# Altium schematic sheet Top.SchDoc
size A3; SheetNumber: 1
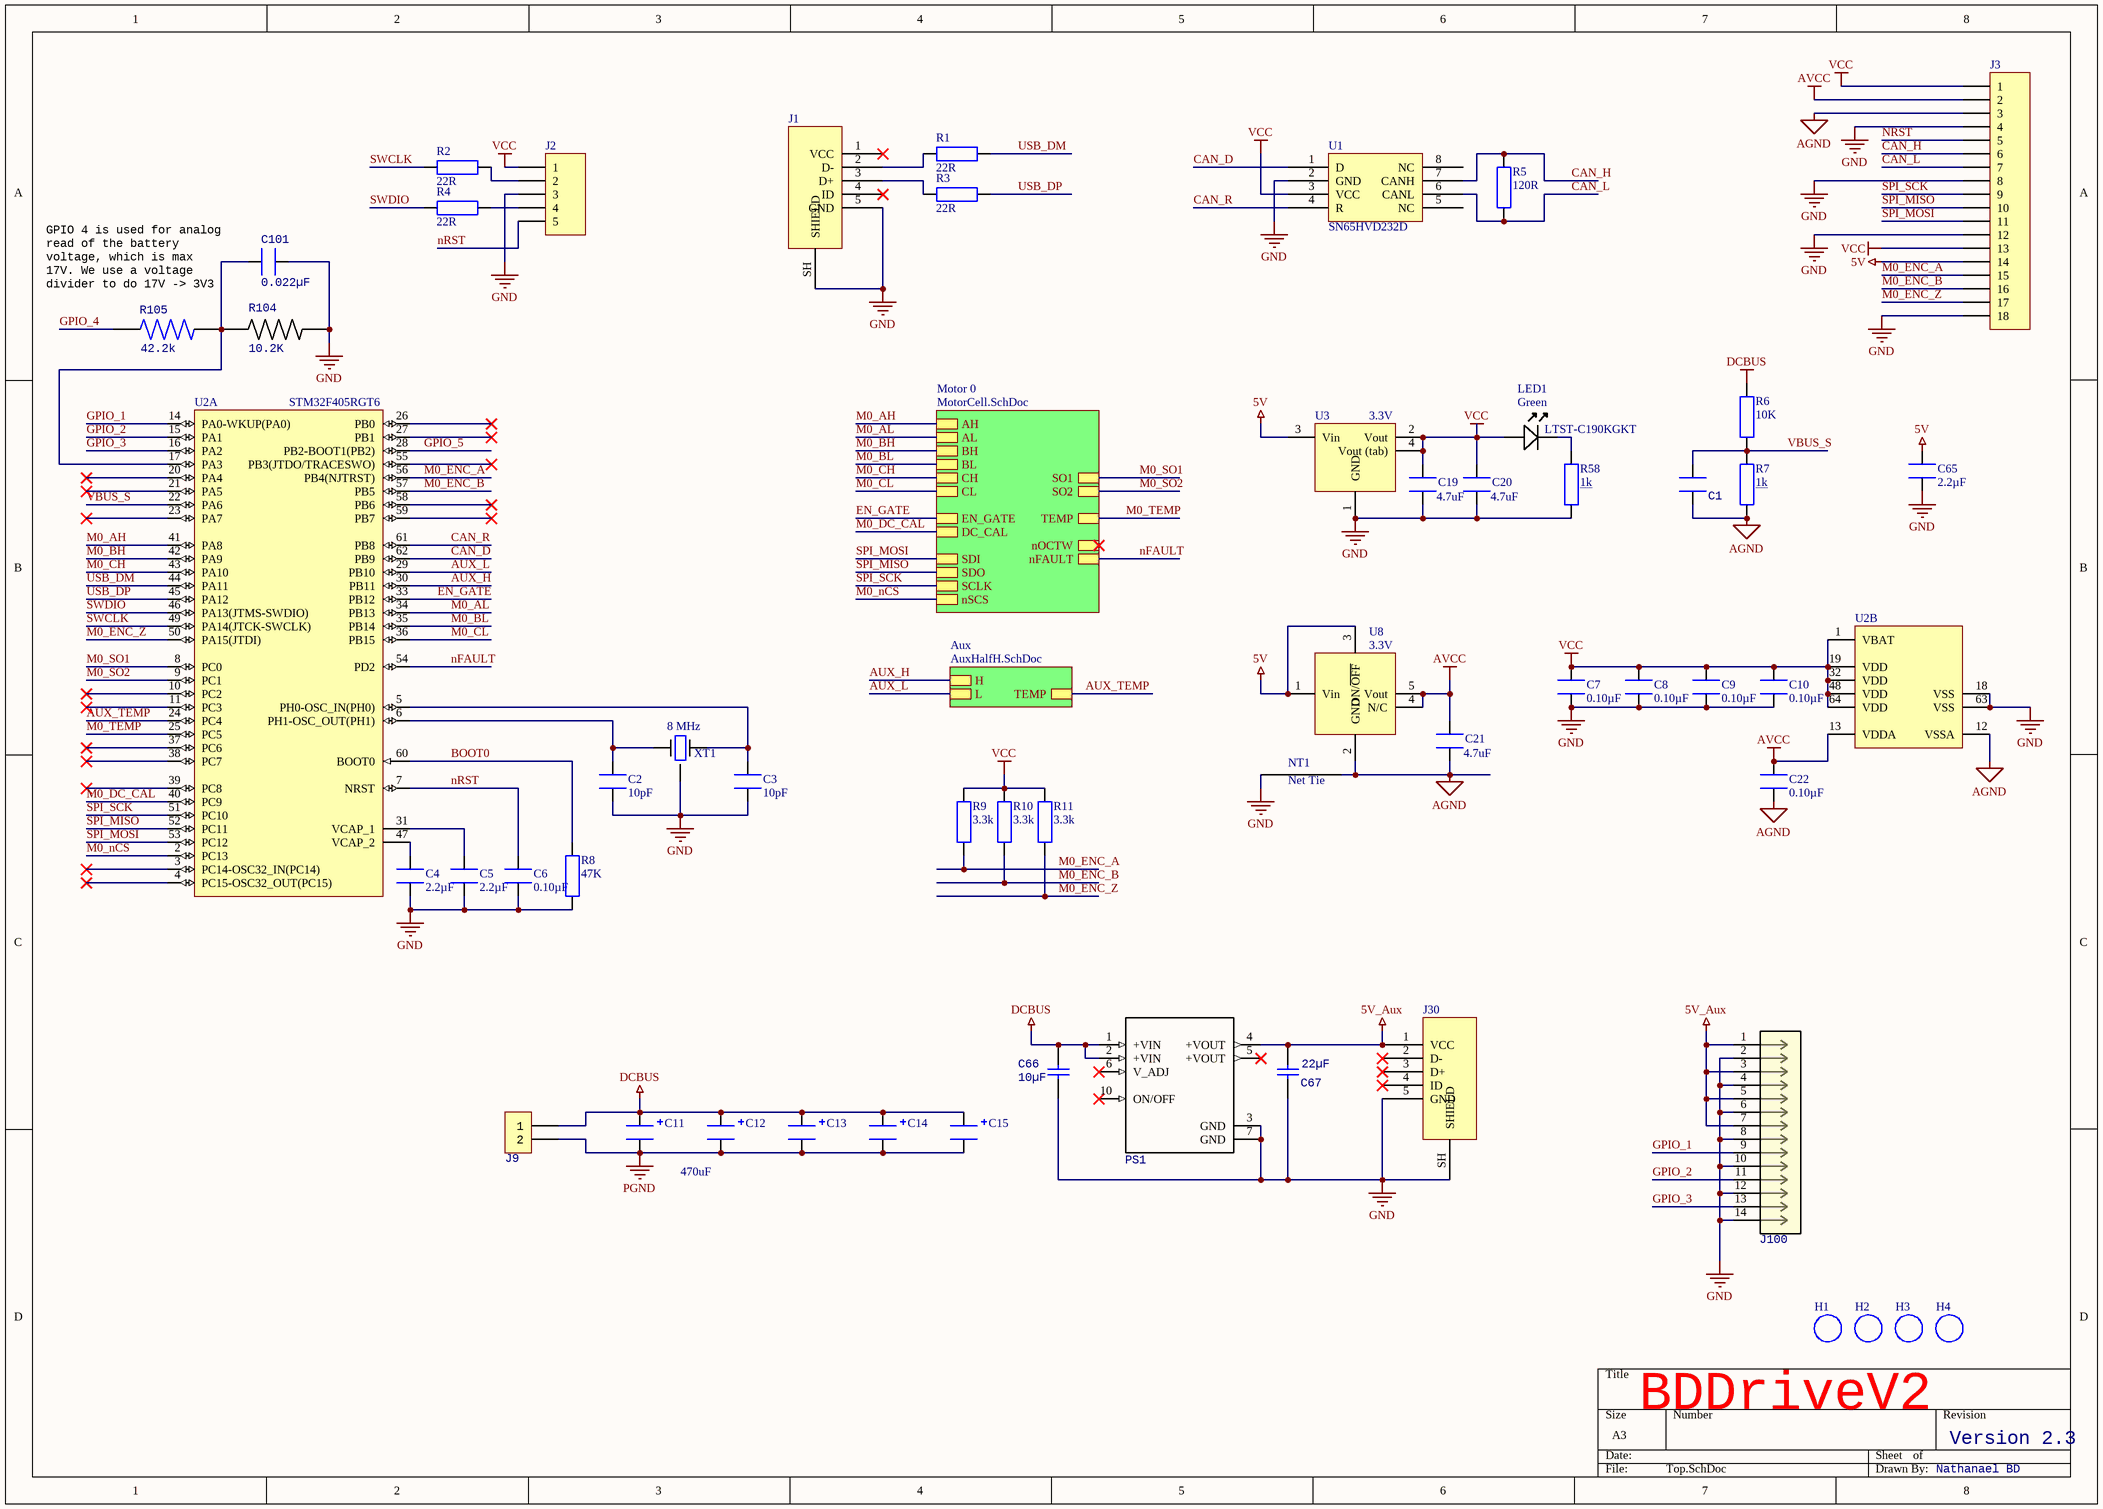
[diagram p0: Top.SchDoc]

## Parts
C1  270pF  [CAPC1608X09L]  (value not drawn)
C2  10pF  [CAPC1608X09L]
C3  10pF  [CAPC1608X09L]
C4  2.2µF  [CAPC1608X09L]
C5  2.2µF  [CAPC1608X09L]
C6  0.10µF  [CAPC1608X09L]
C7  0.10µF  [CAPC1608X09L]
C8  0.10µF  [CAPC1608X09L]
C9  0.10µF  [CAPC1608X09L]
C10  0.10µF  [CAPC1608X09L]
C11  470uF  [CAP_ELEC_SIZE_G]
C12  470uF  [CAP_ELEC_SIZE_G]  (value not drawn)
C13  470uF  [CAP_ELEC_SIZE_G]  (value not drawn)
C14  470uF  [CAP_ELEC_SIZE_G]  (value not drawn)
C15  470uF  [CAP_ELEC_SIZE_G]  (value not drawn)
C19  4.7uF  [CAPC2012X09N]
C20  4.7uF  [CAPC2012X09N]
C21  4.7uF  [CAPC2012X09N]
C22  0.10µF  [CAPC1608X09L]
C65  2.2µF  [CAPC1608X09L]
C66  10µF  [1206 CAP]
C67  22µF  [0805 Cap]
C101  0.022µF  [CAPC1608X09L]
H1  (no value)  [M3 Hole]
H2  (no value)  [M3 Hole]
H3  (no value)  [M3 Hole]
H4  (no value)  [M3 Hole]
J1  (no value)  [USB_0103594-0001LF]
J2  (no value)  [HDR1X5]
J3  Header 18  [HDR1X18]  (value not drawn)
J9  0436500227  [0436500227]  (value not drawn)
J30  (no value)  [USB_0103594-0001LF]
J100  Part Number: 67996-114HLF  [67996-114HLF_AMP]  (value not drawn)
LED1  Green  [LED-0603-GREEN]
NT1  (no value)  [NetTie_2mm]  (net tie, no BOM)
PS1  V78E05-1000-SMT-TR  [V78E05-1000-SMT-TR]  (value not drawn)
R1  22R  [RESC1608X55N]
R2  22R  [RESC1608X55N]
R3  22R  [RESC1608X55N]
R4  22R  [RESC1608X55N]
R5  120R  [RESC1608X55N]
R6  10K  [RESC1608X06L]
R7  1k  [RESC1608X55N]
R8  47K  [RESC1608X55N]
R9  3.3k  [RESC1608X55N]
R10  3.3k  [RESC1608X55N]
R11  3.3k  [RESC1608X55N]
R58  1k  [RESC1608X55N]
R104  10.2K  [RESC2012X60N]
R105  42.2k  [RESC2012X60N]
U1  (no value)  [SOIC127P600X175-8N]
U2  (no value)  [STM-LQFP64_N]  (parts A,B of 2)
U3  3.3V  [SOT223]
U8  3.3V  [SOT23-5]
XT1  value 8 MHz  [DFN220P320X110-4N]  (hidden comment: ABM3B-8.000MHZ-10-1-U-T)

## Sub-sheets
Aux = AuxHalfH.SchDoc: H, L, TEMP
Motor 0 = MotorCell.SchDoc: nFAULT, nOCTW, EN_GATE, DC_CAL, SDI, SDO, SCLK, nSCS, SO1, SO2, AH, AL, BH, BL, CH, CL, TEMP

## Nets
5V: C65.2 J3.14 U3.3(Vin) U8.1(Vin) U8.3(ON/~{OFF})
5V_Aux: C67.1 J30.1(VCC) J100.1 J100.3 J100.5 J100.7 PS1.4(+VOUT)
AGND: C1.1 C21.1 C22.2 J3.3 NT1.2 R7.1 U2.12(VSSA) U8.2(GND)
AVCC: C21.2 C22.1 J3.2 U2.13(VDDA) U8.4(N/C) U8.5(Vout)
DCBUS: C11.1 C12.1 C13.1 C14.1 C15.1 C66.1 J9.1 PS1.1(+VIN) PS1.2(+VIN) R6.2
GND: C2.2 C3.2 C4.1 C5.1 C6.1 C7.2 C8.2 C9.2 C10.2 C19.1 C20.1 C65.1 C66.2 C67.2 C101.1 J1.5(GND) J1.SH(SHIELD) J2.3 J3.4 J3.8 J3.12 J3.18 J30.5(GND) J30.SH(SHIELD) J100.2 J100.4 J100.6 J100.8 J100.10 J100.12 J100.14 NT1.1 PS1.3(GND) PS1.7(GND) R8.1 R58.2 R104.2 U1.2(GND) U2.18(VSS) U2.63(VSS) U3.1(GND) XT1.G
PGND: C11.2 C12.2 C13.2 C14.2 C15.2 J9.2
VCC: C7.1 C8.1 C9.1 C10.1 C19.2 C20.2 J2.1 J3.1 J3.13 LED1.A R9.2 R10.2 R11.2 U1.3(VCC) U2.1(VBAT) U2.19(VDD) U2.32(VDD) U2.48(VDD) U2.64(VDD) U3.2(Vout) U3.4(Vout_(tab))
AUX_H: U2.30(PB11) ; sheet Aux/H
AUX_L: U2.29(PB10) ; sheet Aux/L
AUX_TEMP: U2.24(PC4) ; sheet Aux/TEMP
BOOT0: R8.2 U2.60(BOOT0)
CAN_D: U1.1(D) U2.62(PB9)
CAN_H: J3.6 R5.2 U1.7(CANH)
CAN_L: J3.7 R5.1 U1.6(CANL)
CAN_R: U1.4(R) U2.61(PB8)
EN_GATE: U2.33(PB12) ; sheet Motor 0/EN_GATE
GPIO_1: J100.9 U2.14(PA0-WKUP(PA0))
GPIO_2: J100.11 U2.15(PA1)
GPIO_3: J100.13 U2.16(PA2)
GPIO_4: R105.1
GPIO_5: U2.28(PB2-BOOT1(PB2))
M0_AH: U2.41(PA8) ; sheet Motor 0/AH
M0_AL: U2.34(PB13) ; sheet Motor 0/AL
M0_BH: U2.42(PA9) ; sheet Motor 0/BH
M0_BL: U2.35(PB14) ; sheet Motor 0/BL
M0_CH: U2.43(PA10) ; sheet Motor 0/CH
M0_CL: U2.36(PB15) ; sheet Motor 0/CL
M0_DC_CAL: U2.40(PC9) ; sheet Motor 0/DC_CAL
M0_ENC_A: J3.15 R9.1 U2.56(PB4(NJTRST))
M0_ENC_B: J3.16 R10.1 U2.57(PB5)
M0_ENC_Z: J3.17 R11.1 U2.50(PA15(JTDI))
M0_nCS: U2.2(PC13) ; sheet Motor 0/nSCS
M0_SO1: U2.8(PC0) ; sheet Motor 0/SO1
M0_SO2: U2.9(PC1) ; sheet Motor 0/SO2
M0_TEMP: U2.25(PC5) ; sheet Motor 0/TEMP
nFAULT: U2.54(PD2) ; sheet Motor 0/nFAULT
nRST: C6.2 J2.5 J3.5 U2.7(NRST)
SPI_MISO: J3.10 U2.52(PC11) ; sheet Motor 0/SDO
SPI_MOSI: J3.11 U2.53(PC12) ; sheet Motor 0/SDI
SPI_SCK: J3.9 U2.51(PC10) ; sheet Motor 0/SCLK
SWCLK: R2.2 U2.49(PA14(JTCK-SWCLK))
SWDIO: R4.2 U2.46(PA13(JTMS-SWDIO))
USB_DM: R1.1 U2.44(PA11)
USB_DP: R3.1 U2.45(PA12)
VBUS_S: C1.2 R6.1 R7.2 U2.22(PA6)
NetC2_1: C2.1 U2.6(PH1-OSC_OUT(PH1)) XT1.1
NetC3_1: C3.1 U2.5(PH0-OSC_IN(PH0)) XT1.3
NetC4_2: C4.2 U2.47(VCAP_2)
NetC5_2: C5.2 U2.31(VCAP_1)
NetC101_2: C101.2 R104.1 R105.2 U2.17(PA3)
NetJ1_2: J1.2(D-) R1.2
NetJ1_3: J1.3(D+) R3.2
NetJ2_2: J2.2 R2.1
NetJ2_4: J2.4 R4.1
NetLED1_K: LED1.K R58.1

Not connected (* = marked no-connect by the designer): J1 1(VCC)* 4(ID)*; J30 2(D-)* 3(D+)* 4(ID)*; PS1 5(+VOUT)* 6(V_ADJ)* 10(ON/OFF)*; U1 5(NC) 8(NC); U2 3(PC14-OSC32_IN(PC14))* 4(PC15-OSC32_OUT(PC15))* 10(PC2)* 11(PC3)* 20(PA4)* 21(PA5)* 23(PA7)* 26(PB0)* 27(PB1)* 37(PC6)* 38(PC7)* 39(PC8)* 55(PB3(JTDO/TRACESWO))* 58(PB6)* 59(PB7)*

## Notes on the sheet
- GPIO 4 is used for analog read of the battery voltage, which is max 17V. We use a voltage divider to do 17V -> 3V3
- BDDriveV2
- Version 2.3
- Nathanael BD
- (in symbol NetTie_2mm) Net Tie

## Library data of the parts
C1 = GRM1885C1H271JA01D: CAP CER 270PF 50V NP0 0603; Manufacturer: Murata Electronics North America; Tolerance: ±5%; Temperature Coefficient: C0G, NP0; Supplier 1: Digi-Key; Supplier Part Number 1: 490-1437-1-ND; Manufacturer Part Number: GRM1885C1H271JA01D; RoHS: RoHS Compliant; Category: Capacitors; Stock 1: 46048; Pricing 1: 1=0.1, 10=0.048, 50=0.026, 100=0.022, 250=0.018, 500=0.0154, 1000=0.012 (USD); Packaging: Cut Tape (CT); Capacitance: 270pF; Voltage - Rated: 50V; Mounting Type: Surface Mount, MLCC; Operating Temperature: -55°C ~ 125°C; Applications: General Purpose; Ratings: -; Package / Case: 0603 (1608 Metric); Size / Dimension: 0.063" L x 0.031" W (1.60mm x 0.80mm); Height - Seated (Max): -; Thickness (Max): 0.035" (0.90mm); Lead Spacing: -; Features: -; Lead Style: -; ComponentLink1URL: http://www.murata.com/~/media/webrenewal/support/library/catalog/products/capacitor/mlcc/c02e.pdf; ComponentLink1Description: http://www.murata.com/~/media/webrenewal/support/library/catalog/products/capacitor/mlcc/c02e.pdf
C2 C3 = GRM1885C1H100JA01D: CAP CER 10PF 50V NP0 0603; Manufacturer: Murata Electronics North America; Tolerance: ±5%; Temperature Coefficient: C0G, NP0; Supplier 1: Digi-Key; Supplier Part Number 1: 490-1403-1-ND; Manufacturer Part Number: GRM1885C1H100JA01D; RoHS: RoHS Compliant; Category: Capacitors; Stock 1: 450321; Pricing 1: 1=0.1, 10=0.041, 50=0.0222, 100=0.0187, 250=0.01532, 500=0.0131, 1000=0.0102 (USD); Packaging: Cut Tape (CT); Capacitance: 10pF; Voltage - Rated: 50V; Mounting Type: Surface Mount, MLCC; Operating Temperature: -55°C ~ 125°C; Applications: General Purpose; Ratings: -; Package / Case: 0603 (1608 Metric); Size / Dimension: 0.063" L x 0.031" W (1.60mm x 0.80mm); Height - Seated (Max): -; Thickness (Max): 0.035" (0.90mm); Lead Spacing: -; Features: -; Lead Style: -; ComponentLink1URL: http://www.murata.com/~/media/webrenewal/support/library/catalog/products/capacitor/mlcc/c02e.pdf; ComponentLink1Description: http://www.murata.com/~/media/webrenewal/support/library/catalog/products/capacitor/mlcc/c02e.pdf
C4 C5 C65 = GRM188R61C225KE15D: CAP CER 2.2UF 16V X5R 0603; Manufacturer: Murata Electronics North America; Tolerance: ±10%; Supplier 1: Digi-Key; Supplier Part Number 1: 490-3296-1-ND; Manufacturer Part Number: GRM188R61C225KE15D; RoHS: RoHS Compliant; Category: Capacitors; Stock 1: 1255740; Pricing 1: 1=0.12, 10=0.08, 50=0.046, 100=0.038, 250=0.032, 500=0.0268, 1000=0.022 (USD); Packaging: Cut Tape (CT); Capacitance: 2.2µF; Voltage - Rated: 16V; Temperature Coefficient: X5R; Mounting Type: Surface Mount, MLCC; Operating Temperature: -55°C ~ 85°C; Applications: General Purpose; Ratings: -; Package / Case: 0603 (1608 Metric); Size / Dimension: 0.063" L x 0.031" W (1.60mm x 0.80mm); Height - Seated (Max): -; Thickness (Max): 0.035" (0.90mm); Lead Spacing: -; Features: -; Lead Style: -; ComponentLink1URL: http://www.murata.com/~/media/webrenewal/support/library/catalog/products/capacitor/mlcc/c02e.pdf; ComponentLink1Description: http://www.murata.com/~/media/webrenewal/support/library/catalog/products/capacitor/mlcc/c02e.pdf
C6-C10 C22 = GRM188R71E104KA01D: CAP CER 0.1UF 25V X7R 0603; Manufacturer: Murata Electronics North America; Tolerance: ±10%; Supplier 1: Digi-Key; Supplier Part Number 1: 490-1524-1-ND; Manufacturer Part Number: GRM188R71E104KA01D; RoHS: RoHS Compliant; Category: Capacitors; Stock 1: 1667481; Pricing 1: 1=0.1, 10=0.019, 50=0.0104, 100=0.0088, 250=0.0072, 500=0.00616, 1000=0.0048 (USD); Packaging: Cut Tape (CT); Capacitance: 0.10µF; Voltage - Rated: 25V; Temperature Coefficient: X7R; Mounting Type: Surface Mount, MLCC; Operating Temperature: -55°C ~ 125°C; Applications: General Purpose; Ratings: -; Package / Case: 0603 (1608 Metric); Size / Dimension: 0.063" L x 0.031" W (1.60mm x 0.80mm); Height - Seated (Max): -; Thickness (Max): 0.035" (0.90mm); Lead Spacing: -; Features: -; Lead Style: -; ComponentLink1URL: http://www.murata.com/~/media/webrenewal/support/library/catalog/products/capacitor/mlcc/c02e.pdf; ComponentLink1Description: http://www.murata.com/~/media/webrenewal/support/library/catalog/products/capacitor/mlcc/c02e.pdf
C11-C15 = EEEFP1E471AP: CAP, FP Series, 470 µF, 25 V, Radial Can - SMD, 10 mm
C19-C21 = GRM219R6YA475KA73D: CAP CER 4.7UF 35V X5R 0805
C66 = CL31A106KBHNNNE: CAP CER 10UF 50V X5R 1206; Manufacturer: Samsung Electro-Mechanics America, Inc.; Tolerance: ±10%; Supplier 1: Digi-Key; Supplier Part Number 1: 1276-2876-1-ND; Manufacturer Part Number: CL31A106KBHNNNE; RoHS: RoHS Compliant; Category: Capacitors; Stock 1: 486982; Pricing 1: 1=0.78, 10=0.554, 25=0.4724, 50=0.4184, 100=0.3644, 250=0.31036, 500=0.2699, 1000=0.22942 (CAD); Packaging: Cut Tape (CT); Part Status: Active; Capacitance: 10µF; Voltage - Rated: 50V; Temperature Coefficient: X5R; Operating Temperature: -55°C ~ 85°C; Features: -; Ratings: -; Applications: General Purpose; Mounting Type: Surface Mount, MLCC; Package / Case: 1206 (3216 Metric); Size / Dimension: 0.126" L x 0.063" W (3.20mm x 1.60mm); Height - Seated (Max): -; Thickness (Max): 0.071" (1.80mm); Lead Spacing: -; Lead Style: -; ComponentLink1URL: http://www.samsungsem.com/kr/support/product-search/mlcc/__icsFiles/afieldfile/2016/08/18/S_CL31A106KBHNNNE.pdf; ComponentLink1Description: http://www.samsungsem.com/kr/support/product-search/mlcc/__icsFiles/afieldfile/2016/08/18/S_CL31A106KBHNNNE.pdf
C67 = GRM21BR61E226ME44L: CAP CER 22UF 25V X5R 0805; Manufacturer: Murata Electronics North America; Tolerance: ±20%; Supplier 1: Digi-Key; Supplier Part Number 1: 490-10749-1-ND; Manufacturer Part Number: GRM21BR61E226ME44L; RoHS: RoHS Compliant; Category: Capacitors; Stock 1: 29225; Pricing 1: 1=0.77, 10=0.67, 50=0.4068, 100=0.335, 250=0.26796, 500=0.24406, 1000=0.22013 (CAD); Packaging: Cut Tape (CT); Capacitance: 22µF; Voltage - Rated: 25V; Temperature Coefficient: X5R; Mounting Type: Surface Mount, MLCC; Operating Temperature: -55°C ~ 85°C; Applications: General Purpose; Ratings: -; Package / Case: 0805 (2012 Metric); Size / Dimension: 0.079" L x 0.049" W (2.00mm x 1.25mm); Height - Seated (Max): -; Thickness (Max): 0.057" (1.45mm); Lead Spacing: -; Features: -; Lead Style: -; ComponentLink1URL: http://www.murata.com/~/media/webrenewal/support/library/catalog/products/capacitor/mlcc/c02e.pdf; ComponentLink1Description: http://www.murata.com/~/media/webrenewal/support/library/catalog/products/capacitor/mlcc/c02e.pdf
C101 = GRM188R71E223KA01D: CAP CER 0.022UF 25V X7R 0603; Manufacturer: Murata Electronics North America; Tolerance: ±10%; Supplier 1: Digi-Key; Supplier Part Number 1: 490-9761-1-ND; Manufacturer Part Number: GRM188R71E223KA01D; RoHS: RoHS Compliant; Category: Capacitors; Stock 1: 26666; Pricing 1: 1=0.1, 10=0.061, 50=0.0332, 100=0.0281, 250=0.02296, 500=0.01964, 1000=0.0153 (USD); Packaging: Cut Tape (CT); Capacitance: 0.022µF; Voltage - Rated: 25V; Temperature Coefficient: X7R; Mounting Type: Surface Mount, MLCC; Operating Temperature: -55°C ~ 125°C; Applications: General Purpose; Ratings: -; Package / Case: 0603 (1608 Metric); Size / Dimension: 0.063" L x 0.031" W (1.60mm x 0.80mm); Height - Seated (Max): -; Thickness (Max): 0.035" (0.90mm); Lead Spacing: -; Features: -; Lead Style: -; ComponentLink1URL: http://www.murata.com/~/media/webrenewal/support/library/catalog/products/capacitor/mlcc/c02e.pdf; ComponentLink1Description: http://www.murata.com/~/media/webrenewal/support/library/catalog/products/capacitor/mlcc/c02e.pdf
H1-H4 = M3 Hole: M3 Hole with no copper
J1 J30 = 10103594-0001LF: MICRO USB B, RECEPTACLE, SMT, RA, 5WAY; Supplier 1: Farnell; Supplier Part Number 1: 2293752
J2 = Header 5: Header, 5-Pin; LatestRevisionDate: 17-Jul-2002; LatestRevisionNote: Re-released for DXP Platform.; Publisher: Altium Limited
J3 = Header 18: Header, 18-Pin; LatestRevisionDate: 17-Jul-2002; LatestRevisionNote: Re-released for DXP Platform.; Publisher: Altium Limited
J9 = 0436500227: CONN HEADER 2POS VERT TIN T/H; Manufacturer: Molex, LLC; Manufacturer Part Number: 0436500203; Connector Type: Header, Shrouded; Number of Positions: 2; Number of Positions Loaded: All; Pitch: 0.118" (3.00mm); Supplier 1: Digi-Key; Supplier Part Number 1: WM1870-ND; RoHS: RoHS Compliant; Category: Connectors, Interconnects; Stock 1: 8698; Pricing 1: 1=1.38, 10=1.21, 50=1.0908, 100=1.0433, 250=0.94844, 500=0.85358, 1000=0.75874, 2500=0.68761, 5000=0.66389 (CAD); Packaging: Tray; Contact Type: Male Pin; Number of Rows: 1; Row Spacing: -; Contact Mating Length: -; Mounting Type: Through Hole, Right Angle; Termination: Solder; Fastening Type: Locking Ramp; Features: Board Lock; Contact Finish: Tin; Contact Finish Thickness: 100µin (2.54µm); Color: Black; ComponentLink1URL: http://www.molex.com/pdm_docs/sd/436500203_sd.pdf; ComponentLink1Description: http://www.molex.com/pdm_docs/sd/436500203_sd.pdf
J100 = 67996-114HLF: No Description Available; Vendor: Amphenol; Built_By: EMA_UL_Team; SourceLibrary: Amphenol_2013-08-06_Bergstik_2Row_67996; Manufacturer_Part_Number: 67996-114HLF; Copyright: Copyright (C) 2018 Accelerated Designs. All rights reserved; RefDes: RefDes; Type: DEV; Value: Value
LED1 = LTST-C190KGKT: LED GREEN CLEAR 0603 SMD; Manufacturer: Lite-On Inc.; Lens Color: Colorless; Millicandela Rating: 35mcd; Lens Style/Size: Rectangle with Flat Top, 1.10mm x 0.80mm; Voltage - Forward (Vf) (Typ): 2V; Current - Test: 20mA; Viewing Angle: 130°; Wavelength - Dominant: 571nm; Wavelength - Peak: 574nm; Supplier 1: Digi-Key; Supplier Part Number 1: 160-1435-1-ND; RoHS: RoHS Compliant; Category: Optoelectronics; Stock: 922756; Pricing 1: 1=0.27, 10=0.196, 25=0.1448, 100=0.1034, 250=0.07032, 500=0.06204, 1000=0.0486 (USD); Packaging: Cut Tape (CT); Part Status: Active; Color: Green; Lens Transparency: Clear; Mounting Type: Surface Mount; Features: -; Package / Case: 0603 (1608 Metric); Size / Dimension: 1.60mm L x 0.80mm W; Height (Max): 0.80mm; ComponentLink1URL: http://optoelectronics.liteon.com/upload/download/DS22-2000-074/S_110_LTST-C190KGKT.pdf; ComponentLink1Description: http://optoelectronics.liteon.com/upload/download/DS22-2000-074/S_110_LTST-C190KGKT.pdf; Manufacturer Part Number: LTST-C190KGKT
NT1 = NetTie_2mm
R1-R4 = RC0603FR-0722RL: RES SMD 22 OHM 1% 1/10W 0603; Manufacturer: Yageo; Resistance (Ohms): 22; Power (Watts): 0.1W, 1/10W; Temperature Coefficient: ±100ppm/°C; Supplier 1: Digi-Key; Supplier Part Number 1: 311-22.0HRCT-ND; Manufacturer Part Number: RC0603FR-0722RL; RoHS: RoHS Compliant; Category: Resistors; Stock 1: 575303; Pricing 1: 1=0.1, 10=0.014, 25=0.01, 100=0.0057, 250=0.00436, 500=0.00348, 1000=0.00257, 2500=0.00223 (USD); Packaging: Cut Tape (CT); Tolerance: ±1%; Composition: Thick Film; Features: Moisture Resistant; Operating Temperature: -55°C ~ 155°C; Package / Case: 0603 (1608 Metric); Supplier Device Package: 0603; Size / Dimension: 0.063" L x 0.031" W (1.60mm x 0.80mm); Height: 0.022" (0.55mm); Number of Terminations: 2; ComponentLink1URL: http://www.yageo.com/documents/recent/PYu-RC_Group_51_RoHS_L_04.pdf; ComponentLink1Description: http://www.yageo.com/documents/recent/PYu-RC_Group_51_RoHS_L_04.pdf
R5 = RC0603FR-07120RL: RES SMD 120 OHM 1% 1/10W 0603; Manufacturer: Yageo; Resistance (Ohms): 120; Power (Watts): 0.1W, 1/10W; Temperature Coefficient: ±100ppm/°C; Supplier 1: Digi-Key; Supplier Part Number 1: 311-120HRCT-ND; Manufacturer Part Number: RC0603FR-07120RL; RoHS: RoHS Compliant; Category: Resistors; Stock 1: 1545282; Pricing 1: 1=0.1, 10=0.014, 25=0.01, 100=0.0057, 250=0.00436, 500=0.00348, 1000=0.00257, 2500=0.00223 (USD); Packaging: Cut Tape (CT); Tolerance: ±1%; Composition: Thick Film; Features: Moisture Resistant; Operating Temperature: -55°C ~ 155°C; Package / Case: 0603 (1608 Metric); Supplier Device Package: 0603; Size / Dimension: 0.063" L x 0.031" W (1.60mm x 0.80mm); Height: 0.022" (0.55mm); Number of Terminations: 2; ComponentLink1URL: http://www.yageo.com/documents/recent/PYu-RC_Group_51_RoHS_L_04.pdf; ComponentLink1Description: http://www.yageo.com/documents/recent/PYu-RC_Group_51_RoHS_L_04.pdf
R6 = RC0603FR-0710KL: RES SMD 10K OHM 1% 1/10W 0603; Manufacturer: Yageo; Power (Watts): 0.1W, 1/10W; Temperature Coefficient: ±100ppm/°C; Supplier 1: Digi-Key; Supplier Part Number 1: 311-10.0KHRCT-ND; Manufacturer Part Number: RC0603FR-0710KL; RoHS: RoHS Compliant; Category: Resistors; Stock 1: 13504930; Pricing 1: 1=0.1, 10=0.014, 25=0.01, 100=0.0057, 250=0.00436, 500=0.00348, 1000=0.00257, 2500=0.00223 (USD); Packaging: Cut Tape (CT); Resistance (Ohms): 10k; Tolerance: ±1%; Composition: Thick Film; Features: Moisture Resistant; Operating Temperature: -55°C ~ 155°C; Package / Case: 0603 (1608 Metric); Supplier Device Package: 0603; Size / Dimension: 0.063" L x 0.031" W (1.60mm x 0.80mm); Height: 0.022" (0.55mm); Number of Terminations: 2; ComponentLink1URL: http://www.yageo.com/documents/recent/PYu-RC_Group_51_RoHS_L_04.pdf; ComponentLink1Description: http://www.yageo.com/documents/recent/PYu-RC_Group_51_RoHS_L_04.pdf
R7 R58 = RC0603FR-071KL: RES SMD 1K OHM 1% 1/10W 0603; Manufacturer: Yageo; Power (Watts): 0.1W, 1/10W; Temperature Coefficient: ±100ppm/°C; Supplier 1: Digi-Key; Supplier Part Number 1: 311-1.00KHRCT-ND; RoHS: RoHS Compliant; Category: Resistors; Stock 1: 6734836; Pricing 1: 1=0.1, 10=0.014, 25=0.01, 100=0.0057, 250=0.00436, 500=0.00348, 1000=0.00257, 2500=0.00223 (USD); Packaging: Cut Tape (CT); Tolerance: ±1%; Composition: Thick Film; Features: Moisture Resistant; Operating Temperature: -55°C ~ 155°C; Package / Case: 0603 (1608 Metric); Supplier Device Package: 0603; Size / Dimension: 0.063" L x 0.031" W (1.60mm x 0.80mm); Height: 0.022" (0.55mm); Number of Terminations: 2; ComponentLink1URL: http://www.yageo.com/documents/recent/PYu-RC_Group_51_RoHS_L_04.pdf; ComponentLink1Description: http://www.yageo.com/documents/recent/PYu-RC_Group_51_RoHS_L_04.pdf; Manufacturer Part Number: RC0603FR-071KL; Resistance (Ohms): 1k
R8 = RC0603FR-0747KL: RES SMD 47K OHM 1% 1/10W 0603; Manufacturer: Yageo; Power (Watts): 0.1W, 1/10W; Temperature Coefficient: ±100ppm/°C; Supplier 1: Digi-Key; Supplier Part Number 1: 311-47.0KHRCT-ND; Manufacturer Part Number: RC0603FR-0747KL; RoHS: RoHS Compliant; Category: Resistors; Stock 1: 930868; Pricing 1: 1=0.1, 10=0.014, 25=0.01, 100=0.0057, 250=0.00436, 500=0.00348, 1000=0.00257, 2500=0.00223 (USD); Packaging: Cut Tape (CT); Resistance (Ohms): 47k; Tolerance: ±1%; Composition: Thick Film; Features: Moisture Resistant; Operating Temperature: -55°C ~ 155°C; Package / Case: 0603 (1608 Metric); Supplier Device Package: 0603; Size / Dimension: 0.063" L x 0.031" W (1.60mm x 0.80mm); Height: 0.022" (0.55mm); Number of Terminations: 2; ComponentLink1URL: http://www.yageo.com/documents/recent/PYu-RC_Group_51_RoHS_L_04.pdf; ComponentLink1Description: http://www.yageo.com/documents/recent/PYu-RC_Group_51_RoHS_L_04.pdf
R9-R11 = RC0603FR-073K3L: RES SMD 3.3K OHM 1% 1/10W 0603; Manufacturer: Yageo; Power (Watts): 0.1W, 1/10W; Temperature Coefficient: ±100ppm/°C; Supplier 1: Digi-Key; Supplier Part Number 1: 311-3.30KHRCT-ND; RoHS: RoHS Compliant; Category: Resistors; Stock 1: 420019; Pricing 1: 1=0.1, 10=0.014, 25=0.01, 100=0.0057, 250=0.00436, 500=0.00348, 1000=0.00257, 2500=0.00223 (USD); Packaging: Cut Tape (CT); Tolerance: ±1%; Composition: Thick Film; Features: Moisture Resistant; Operating Temperature: -55°C ~ 155°C; Package / Case: 0603 (1608 Metric); Supplier Device Package: 0603; Size / Dimension: 0.063" L x 0.031" W (1.60mm x 0.80mm); Height: 0.022" (0.55mm); Number of Terminations: 2; ComponentLink1URL: http://www.yageo.com/documents/recent/PYu-RC_Group_51_RoHS_L_04.pdf; ComponentLink1Description: http://www.yageo.com/documents/recent/PYu-RC_Group_51_RoHS_L_04.pdf; Manufacturer Part Number: RC0603FR-073K3L; Resistance (Ohms): 3.3k
R104 = ERA-6AEB1022V: RES 10.2K OHM 0.1% 1/8W 0805; SnapEDA_Link: https://www.snapeda.com/parts/ERA-6AEB1021V/Panasonic/view-part/3719598/?ref=snap; Check_prices: https://www.snapeda.com/parts/ERA-6AEB1021V/Panasonic/view-part/3719598/?ref=eda; Value: *
R105 = ERA-6AEB4222V: RES 42.2K OHM 0.1% 1/8W 0805; MP: ERA-6AEB4221V; MF: Panasonic; SnapEDA_Link: https://www.snapeda.com/parts/ERA-6AEB4221V/Panasonic/view-part/3720214/?ref=snap; Arrow_Electronics-Purchase-URL: https://snapeda.com/shop?store=Arrow+Electronics&id=3720214; Mouser-Purchase-URL: https://snapeda.com/shop?store=Mouser&id=3720214; Arrow_Europe-Purchase-URL: https://snapeda.com/shop?store=Arrow+Europe&id=3720214; Value: *; DigiKey-Purchase-URL: https://snapeda.com/shop?store=DigiKey&id=3720214; Package: 2012 Panasonic Electronic Components; Digi-Key_Part_Number: P4.22KDACT-ND
U1 = SN65HVD232D: 3.3-V CAN Bus Transceiver; PartNumber: SN65HVD232D
U2 = STM32F405RGT6: ARM Cortex-M4 32-bit MCU+FPU, 210 DMIPS, 1024 kB Flash, 192 kB Internal RAM, 51 I/Os, 64-pin LQFP, -40 to 85 degC, Tray; Manufacturer: STMicroelectronics; D/A Converter: 2x12-bit; FLASH Size (Prog) (kB): 1024; I/Os (High Current): 51; Internal RAM Size (kB): 192; Operating Frequency(F) (Processor speed) (MHz): 168; Supply Voltage(Vcc) max (V): 3.6; Supply Voltage(Vcc) min (V): 1.8; DatasheetVersion: Rev. 4; PackageVersion: Rev. 4, 06/2013; PackageReference: LQFP64; PackageDescription: 64-Pin Low Profile Quad Flat Package, 10 x 10 mm Body, 0.5 mm Pitch; Supplier 1: Digi-Key; Supplier Part Number 1: 497-11767-ND; Supplier 2: Farnell; Supplier Part Number 2: 2064363; Supplier 3: Newark; Supplier Part Number 3: 73T2329; Supplier 4: Mouser; Supplier Part Number 4: 511-STM32F405RGT6; Core: ARM Cortex-M4; Packing: Tray; Mounting Technology: Surface Mount; PartNumber: STM32F405RGT6; ComponentLink1Description: Manufacturer URL; ComponentLink1URL: http://www.st.com/web/en/home.html; ComponentLink2Description: Datasheet; ComponentLink2URL: http://www.st.com/st-web-ui/static/active/en/resource/technical/document/datasheet/DM00037051.pdf; ComponentLink3Description: Package Specification; ComponentLink3URL: http://www.st.com/st-web-ui/static/active/en/resource/technical/document/datasheet/DM00037051.pdf
U3 = AZ1117EH-3.3TRG1: IC REG LDO 3.3V 1A SOT223; Manufacturer: Diodes Incorporated; Regulator Topology: Positive Fixed; Voltage - Dropout (Typical): 1.1V @ 1A; Voltage - Input: Up to 13V; Supplier 1: Digi-Key; Supplier Part Number 1: AZ1117EH-3.3TRG1DICT-ND; RoHS: RoHS Compliant; Category: Integrated Circuits (ICs); Stock 1: 22748; Pricing 1: 1=0.43, 10=0.321, 100=0.1815, 500=0.12022, 1000=0.09216 (USD); Packaging: Cut Tape (CT); Part Status: Active; Voltage - Output: 3.3V; Current - Output: 1A; Current - Limit (Min): -; Operating Temperature: -40°C ~ 125°C; Mounting Type: Surface Mount; Package / Case: TO-261-4, TO-261AA; Supplier Device Package: SOT-223; ComponentLink1URL: http://www.diodes.com/assets/Datasheets/AZ1117E.pdf; ComponentLink1Description: http://www.diodes.com/assets/Datasheets/AZ1117E.pdf
U8 = LP5907MFX-3.3/NOPB: IC REG LDO 3.3V 0.25A SOT23-5; Manufacturer: Texas Instruments; Regulator Topology: Positive Fixed; Current - Output: 250mA; Voltage - Input: Up to 5.5V; Supplier 1: Digi-Key; Supplier Part Number 1: 296-38557-1-ND; RoHS: RoHS Compliant; Category: Integrated Circuits (ICs); Stock 1: 39845; Pricing 1: 1=0.57, 10=0.487, 100=0.3634, 500=0.28552, 1000=0.22063 (USD); Packaging: Cut Tape (CT); Part Status: Active; Voltage - Output: 3.3V; Voltage - Dropout (Typical): -; Current - Limit (Min): -; Operating Temperature: -40°C ~ 125°C; Mounting Type: Surface Mount; Package / Case: SC-74A, SOT-753; Supplier Device Package: SOT-23; ComponentLink1URL: http://www.ti.com/lit/ds/symlink/lp5907.pdf; ComponentLink1Description: http://www.ti.com/lit/ds/symlink/lp5907.pdf
XT1 = ABM3B-8.000MHZ-10-1-U-T: Crystal 8MHz ±10ppm 10pF 200 Ohm -10°C ~ 60°C Surface Mount 4-SMD, No Lead (DFN, LCC)
PS1 = V78E05-1000-SMT-TR: Value: *